# EAGLE design Universal Remote (EAGLE 7.2.0)
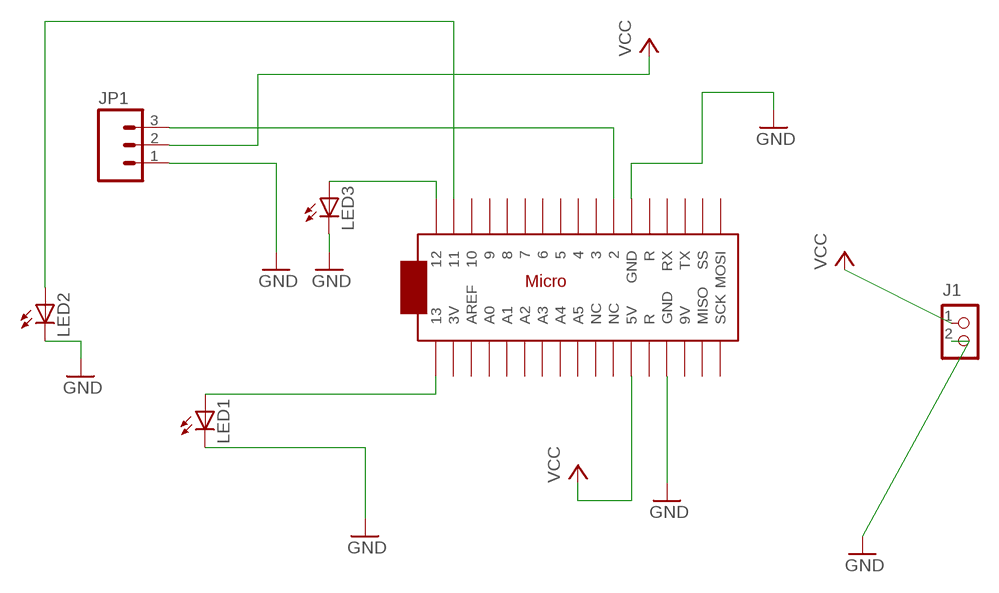
[diagram p0: schematic, sheet 1]

## Parts
J1  CON_TERMINAL_BLOCK_02-5MM  [TERMINAL_BLOCK_2P_5]
JP1  M03JST-PTH-VERT  [JST-3-PTH-VERT]
LED1  LED5MM  [LED5MM]
LED2  LED5MM  [LED5MM]
LED3  LED5MM  [LED5MM]
U$1  ARDUINOMICRO  [ARDUINOMICRO]

## Nets
GND: J1.2 JP1.1 LED1.K(C) LED2.K(C) LED3.K(C) U$1.P$12(GND) U$1.P$21(GND)
N$1: LED1.A U$1.P$34
N$2: LED3.A U$1.P$1
N$3: LED2.A U$1.P$2
N$4: JP1.3 U$1.P$11
VCC: J1.1 JP1.2 U$1.P$23(5V)
Unconnected: U$1.P$3 U$1.P$4 U$1.P$5 U$1.P$6 U$1.P$7 U$1.P$8 U$1.P$9 U$1.P$10 U$1.P$13(R) U$1.P$14(RX) U$1.P$15(TX) U$1.P$16(SS) U$1.P$17(MOSI) U$1.P$18(SCK) U$1.P$19(MISO) U$1.P$20(9V) U$1.P$22(R) U$1.P$24(NC) U$1.P$25(NC) U$1.P$26(A5) U$1.P$27(A4) U$1.P$28(A3) U$1.P$29(A2) U$1.P$30(A1) U$1.P$31(A0) U$1.P$32(AREF) U$1.P$33(3V)

## Library data of the parts
J1 = dp_devices:CON_TERMINAL_BLOCK_02: 2 poles wire to board terminal block
JP1 = CommonParts:M03: Header 3 Standard 3-pin 0.1" header. Use with straight break away headers (SKU : PRT-00116), right angle break away headers (PRT-00553), swiss pins (PRT-00743), machine pins (PRT-00117), and female headers (PRT-00115). Molex polarized connector foot print use with SKU : PRT-08232 with associated crimp pins and housings.
LED1-LED3 = CommonParts:LED: LED OSRAM: - CHIPLED LG R971, LG N971, LY N971, LG Q971, LY Q971, LO R971, LY R971 LH N974, LH R974 LS Q976, LO Q976, LY Q976 LO Q996 - Hyper CHIPLED LW Q18S LB Q993, LB Q99A, LB R99A - SideLED LS A670, LO A670, LY A670, LG A670, LP A670 LB A673, LV A673, LT A673, LW A673 LH A674 LY A675 LS A676, LA A676, LO A676, LY A676, LW A676 LS A679, LY A679, LG A679 - Hyper Micro SIDELED® LS Y876, LA Y876, LO Y876, LY Y876 LT Y87S - SmartLED LW L88C, LW L88S LB L89C, LB L89S, LG L890 LS L89K, LO L89K, LY L89K LS L896, LA L896, LO L896, LY L896 - TOPLED LS T670, LO T670, LY T670, LG T670, LP T670 LSG T670, LSP T670, LSY T670, LOP T670, LYG T670 LG T671, LOG T671, LSG T671 LB T673, LV T673, LT T673, LW T673 LH T674 LS T676, LA T676, LO T676, LY T676, LB T676, LH T676, LSB T676, LW T676 LB T67C, LV T67C, LT T67C, LS T67K, LO T67K, LY T67K, LW E67C LS E67B, LA E67B, LO E67B, LY E67B, LB E67C, LV E67C, LT E67C LW T67C LS T679, LY T679, LG T679 LS T770, LO T770, LY T770, LG T770, LP T770 LB T773, LV T773, LT T773, LW T773 LH T774 LS E675, LA E675, LY E675, LS T675 LS T776, LA T776, LO T776, LY T776, LB T776 LHGB T686 LT T68C, LB T68C - Hyper Mini TOPLED® LB M676 - Mini TOPLED Santana® LG M470 LS M47K, LO M47K, LY M47K Source: http://www.osram.convergy.de LUXEON: - LUMILED® LXK2-PW12-R00, LXK2-PW12-S00, LXK2-PW14-U00, LXK2-PW14-V00 LXK2-PM12-R00, LXK2-PM12-S00, LXK2-PM14-U00 LXK2-PE12-Q00, LXK2-PE12-R00, LXK2-PE12-S00, LXK2-PE14-T00, LXK2-PE14-U00 LXK2-PB12-K00, LXK2-PB12-L00, LXK2-PB12-M00, LXK2-PB14-N00, LXK2-PB14-P00, LXK2-PB14-Q00 LXK2-PR12-L00, LXK2-PR12-M00, LXK2-PR14-Q00, LXK2-PR14-R00 LXK2-PD12-Q00, LXK2-PD12-R00, LXK2-PD12-S00 LXK2-PH12-R00, LXK2-PH12-S00 LXK2-PL12-P00, LXK2-PL12-Q00, LXK2-PL12-R00 Source: www.luxeon.com KINGBRIGHT: KA-3528ASYC Source: www.kingbright.com
U$1 = CommonParts:ARDUINOMICRO

## Board
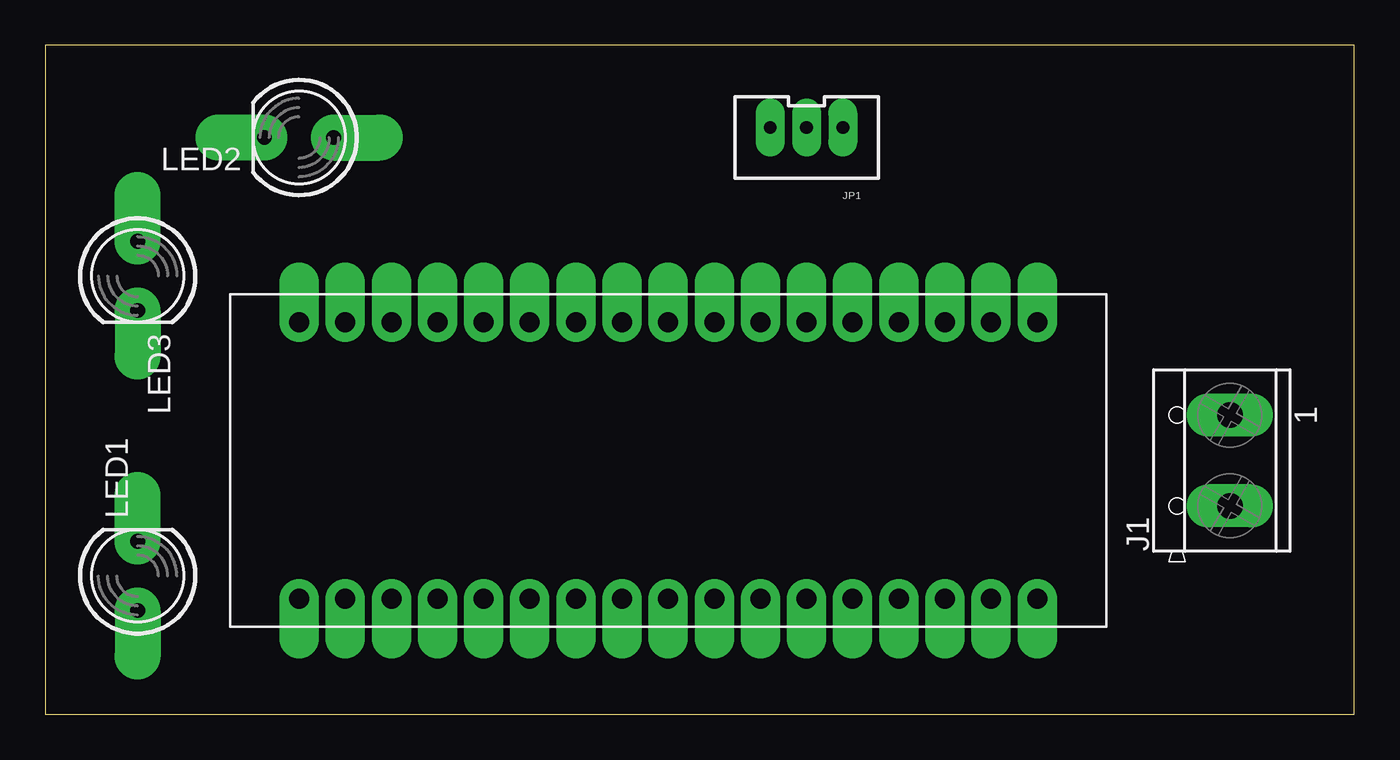
[diagram p1: board, top side]
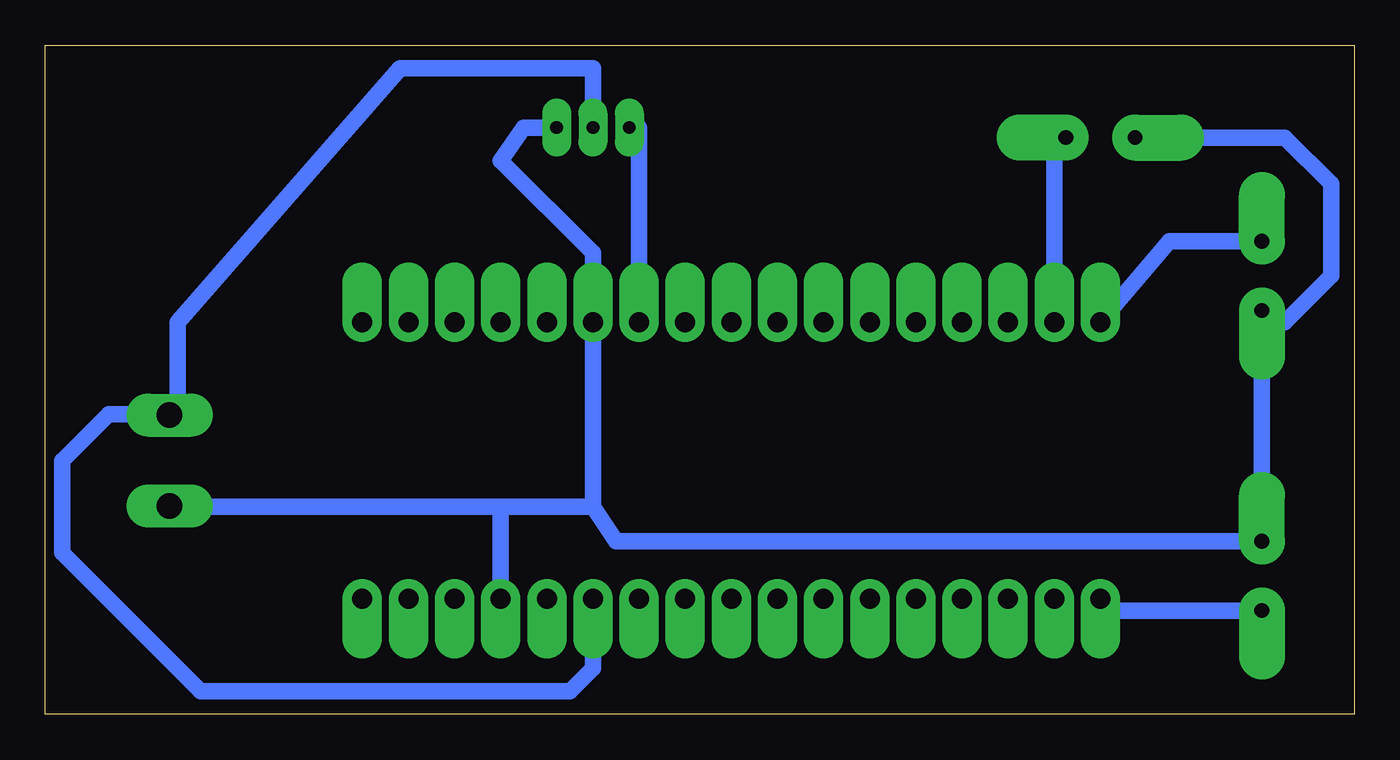
[diagram p2: board, bottom side, seen from below]

Size 72.06 x 36.82 mm. Coordinates in mm from the lower left corner, seen from the top.
Outline: 0,0 72.06,0 72.06,36.82 0,36.82 0,0
Copper layers (1*16): Top 0.035mm / dielectric 1.5mm / Bottom 0.035mm
Design rules "default": minimum track width 40mil, minimum drill 24mil, track to track 40mil, track to pad 40mil, pad to pad 40mil, via to via 40mil, smd to smd 8mil, copper to edge 40mil, drill to drill 8mil, minimum pad ring 10mil, minimum via ring 8mil, stop-mask expansion 4mil, vias tented up to drill 0mil, thermal gap 10mil

### Footprints (pad centres in the part's own frame; a part is rotated, then mirrored left to right if it is on the bottom)
TERMINAL_BLOCK_2P_5 = drill 1.4 pad 2.38 long: 1 2.5,-0.45; 2 -2.5,-0.45
JST-3-PTH-VERT = drill 0.7 pad 1.6 long: 1 -2,-0.55; 2 0,-0.55; 3 2,-0.55
LED5MM = drill 0.813 pad 2.54 offset: A -1.905,0; K 1.905,0
ARDUINOMICRO = drill 1.1 pad 2.184 offset: P$1 -20.32,7.62; P$2 -17.78,7.62; P$3 -15.24,7.62; P$4 -12.7,7.62; P$5 -10.16,7.62; P$6 -7.62,7.62; P$7 -5.08,7.62; P$8 -2.54,7.62; P$9 0,7.62; P$10 2.54,7.62; P$11 5.08,7.62; P$12 12.7,-7.62; P$13 10.16,-7.62; P$14 12.7,7.62; P$15 15.24,7.62; P$16 17.78,7.62; P$17 20.32,7.62; P$18 20.32,-7.62; P$19 17.78,-7.62; P$20 15.24,-7.62; P$21 7.62,7.62; P$22 10.16,7.62; P$23 7.62,-7.62; P$24 5.08,-7.62; P$25 2.54,-7.62; P$26 0,-7.62; P$27 -2.54,-7.62; P$28 -5.08,-7.62; P$29 -7.62,-7.62; P$30 -10.16,-7.62; P$31 -12.7,-7.62; P$32 -15.24,-7.62; P$33 -17.78,-7.62; P$34 -20.32,-7.62

### Placement (x,y rotation side)
J1  64.77,13.97 90 top
JP1  41.91,31.75 180 top
LED1  5.08,7.62 90 top
LED2  13.97,31.75 180 top
LED3  5.08,24.13 270 top
U$1  34.29,13.97 0 top

### Tracks (layer width: path | path; a pad name or v marks a point on that pad's centre or on a via)
GND
  Bottom 0.406: 65.22,11.43 J1.2 | LED3.K 5.08,21.59 3.81,21.59
  Bottom 0.914: U$1.P$12 46.99,11.43 | 46.99,11.43 65.22,11.43 | 46.99,11.43 41.91,11.43 | 41.91,11.43 U$1.P$21 41.91,25.4 46.99,30.48 45.72,32.3 JP1.1 | 41.91,11.43 40.64,9.53 LED1.K 5.08,21.59 | LED2.K 3.81,31.75 1.27,29.21 1.27,24.13 3.81,21.59
N$1
  Bottom 0.914: LED1.A 13.97,5.71 U$1.P$34
N$2
  Bottom 0.914: LED3.A 10.16,26.04 U$1.P$1
N$3
  Bottom 0.406: 16.51,31.75 LED2.A
  Bottom 0.914: U$1.P$2 16.51,31.75
N$4
  Bottom 0.406: JP1.3 39.37,32.3
  Bottom 0.914: 39.37,32.3 U$1.P$11
VCC
  Bottom 0.406: 65.22,16.51 J1.1 64.77,16.47
  Bottom 0.914: U$1.P$23 41.91,2.54 43.18,1.27 63.5,1.27 71.12,8.89 71.12,13.97 68.58,16.51 65.22,16.51 | JP1.2 41.91,35.56 52.52,35.56 64.77,21.59 64.77,16.47